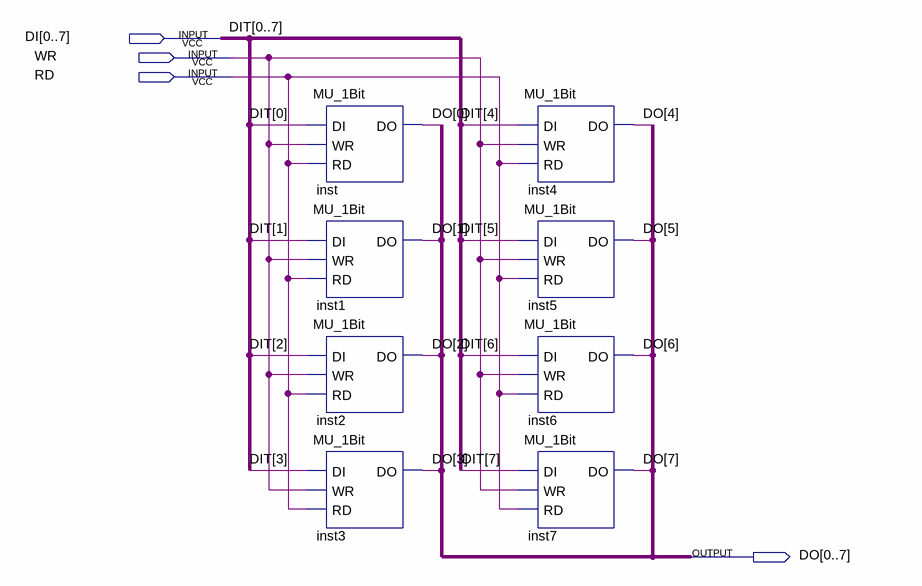
[diagram p0: schematic sheet]
// Quartus schematic MU_1Byte.bdf as structural Verilog: 8 symbols, 4 pins
module MU_1Byte (
  input  [0:7] DI,
  input  WR,
  input  RD,
  output [0:7] DO
);

  MU_1Bit inst (.DI(DI[0]), .WR(WR), .RD(RD), .DO(DO[0]));
  MU_1Bit inst1 (.DI(DI[1]), .WR(WR), .RD(RD), .DO(DO[1]));
  MU_1Bit inst2 (.DI(DI[2]), .WR(WR), .RD(RD), .DO(DO[2]));
  MU_1Bit inst3 (.DI(DI[3]), .WR(WR), .RD(RD), .DO(DO[3]));
  MU_1Bit inst4 (.DI(DI[4]), .WR(WR), .RD(RD), .DO(DO[4]));
  MU_1Bit inst5 (.DI(DI[5]), .WR(WR), .RD(RD), .DO(DO[5]));
  MU_1Bit inst6 (.DI(DI[6]), .WR(WR), .RD(RD), .DO(DO[6]));
  MU_1Bit inst7 (.DI(DI[7]), .WR(WR), .RD(RD), .DO(DO[7]));

  // Other names for the same wires on the sheet: DIT[7:0] = {DI[7], DI[6], DI[5], DI[4], DI[3], DI[2], DI[1], DI[0]}
endmodule
